# EAGLE design Steeringwheel wired remote (EAGLE 7.2.0)
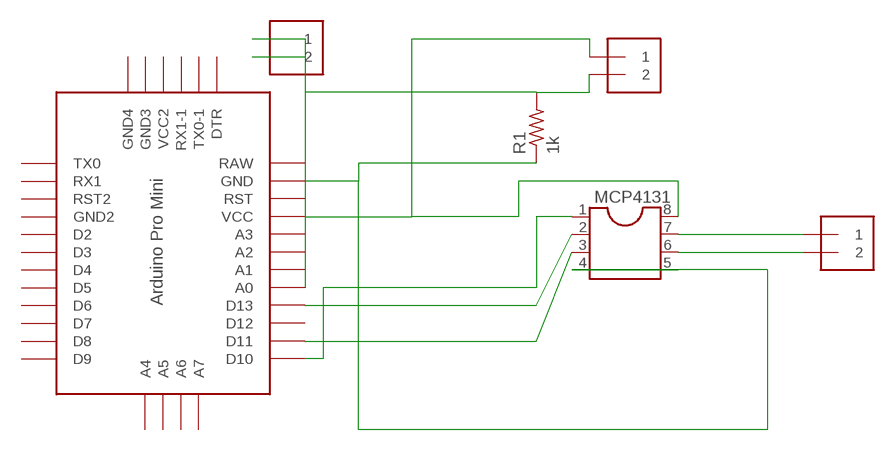
[diagram p0: schematic, sheet 1]

## Parts
IC1  DIL8  [DIL08]
INPUT  1X2-3.5MM  [1X2-3.5MM]
OUTPUT  1X2-3.5MM  [1X2-3.5MM]
POWER  1X2-3.5MM  [1X2-3.5MM]
R1  1k  R-US_0204/5  [0204/5]
U$1  PRO-MINI  [PRO-MINI]

## Nets
N$1: IC1.4(GND) IC1.5(P0A) POWER.1 R1.1 U$1.GND
N$2: IC1.1(!CS) U$1.D10
N$3: IC1.2(SCK) U$1.D13
N$4: IC1.3(SDI) U$1.D11
N$5: IC1.8(VCC) INPUT.1 POWER.2 U$1.VCC
N$6: IC1.7(P0B) OUTPUT.1
N$7: IC1.6(P0W) OUTPUT.2
N$8: INPUT.2 R1.2 U$1.A0
Unconnected: U$1.A1 U$1.A2 U$1.A3 U$1.A4 U$1.A5 U$1.A6 U$1.A7 U$1.D2 U$1.D3 U$1.D4 U$1.D5 U$1.D6 U$1.D7 U$1.D8 U$1.D9 U$1.D12 U$1.DTR U$1.GND1(GND2) U$1.GND2(GND4) U$1.GND3 U$1.RST U$1.RST1(RST2) U$1.RX1 U$1.RX1-1 U$1.TX0 U$1.TX0-1 U$1.VCC1(VCC2)

## Power pins joined to a net without a drawn wire
RAW: U$1.RAW

## Library data of the parts
IC1 = Own:DIL8: Dual In Line / Socket
INPUT OUTPUT POWER = adafruit:1X2: 3.5mm Terminal block http://www.ladyada.net/library/pcb/eaglelibrary.html
R1 = adafruit:R-US_: RESISTOR, American symbol
U$1 = Arduino-clone:PRO-MINI: Arduion Pro Mini Clone V1.0 www.betemcu.cu

## Board
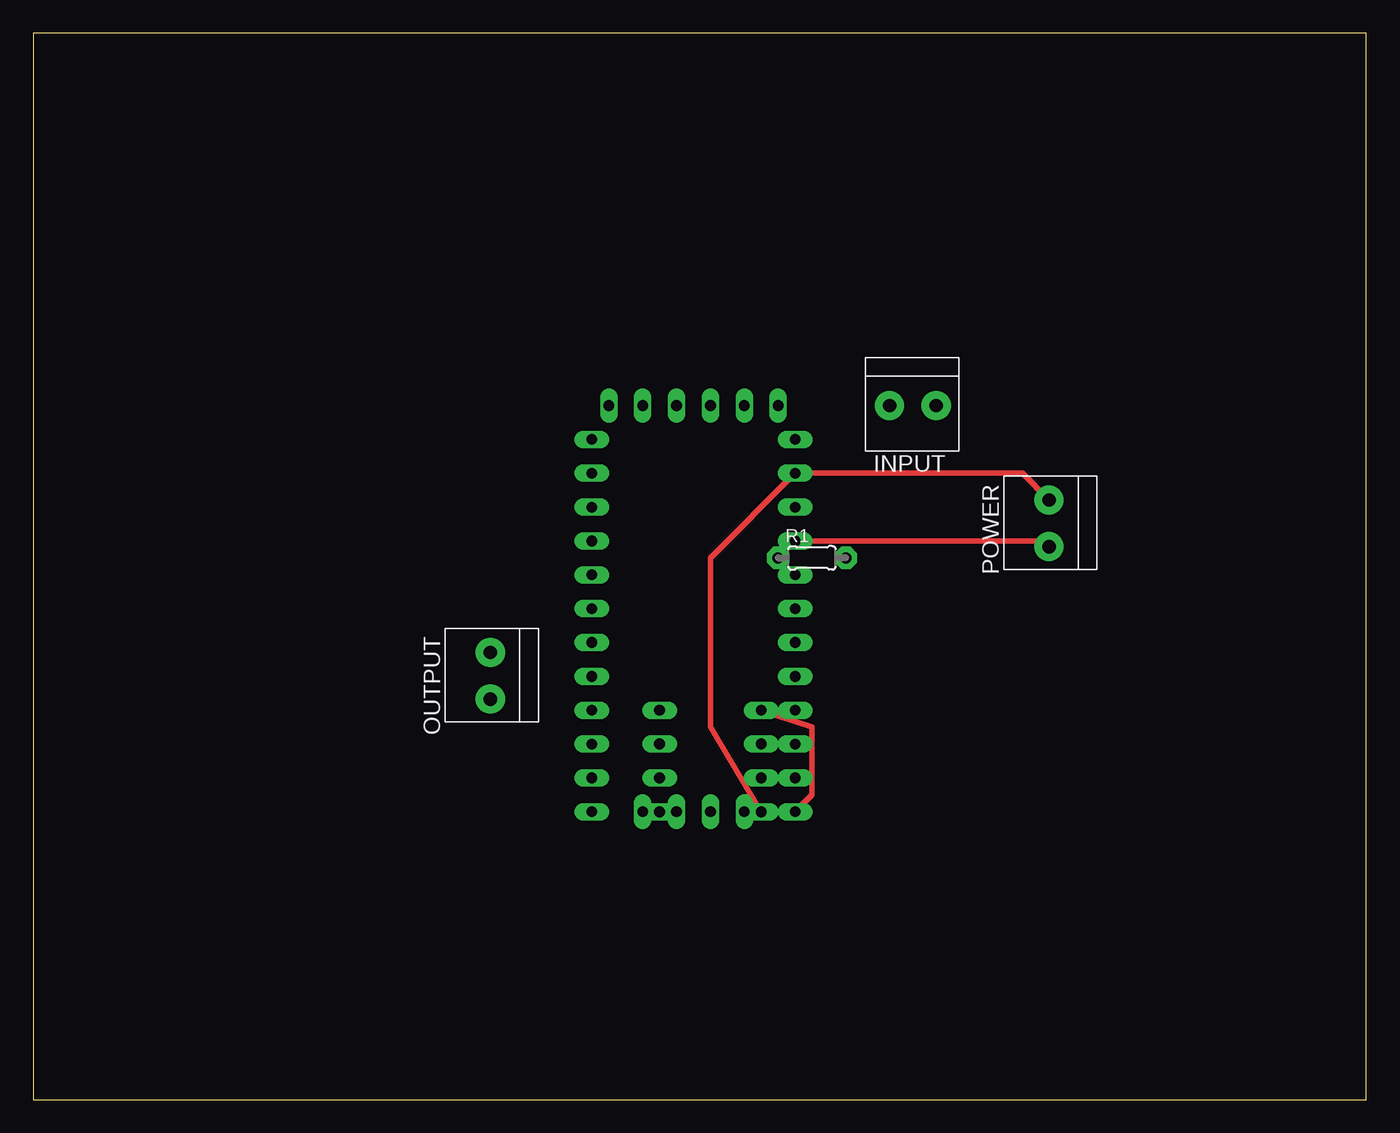
[diagram p1: board, top side]
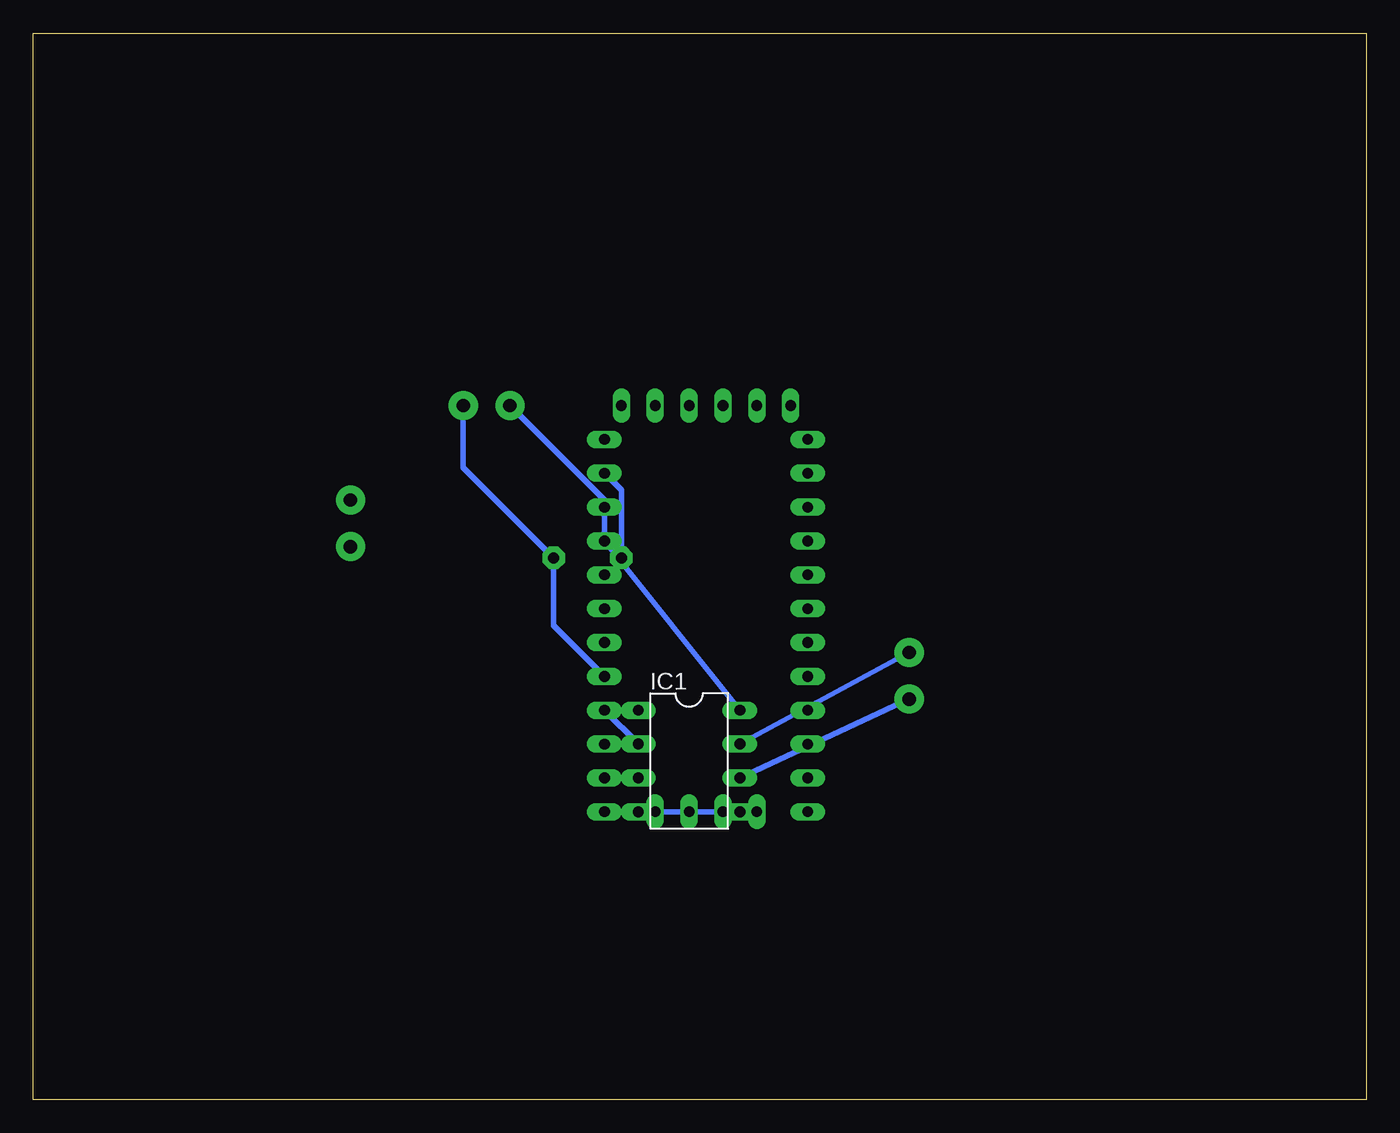
[diagram p2: board, bottom side, seen from below]

Size 100 x 80 mm. Coordinates in mm from the lower left corner, seen from the top.
Outline: 0,0 100,0 100,80 0,80 0,0
Copper layers (1*16): Top 0.035mm / dielectric 1.5mm / Bottom 0.035mm
Design rules "default": minimum track width 10mil, minimum drill 24mil, track to track 8mil, track to pad 8mil, pad to pad 8mil, via to via 8mil, smd to smd 8mil, copper to edge 40mil, drill to drill 8mil, minimum pad ring 10mil, minimum via ring 8mil, stop-mask expansion 4mil, vias tented up to drill 0mil, thermal gap 10mil

### Footprints (pad centres in the part's own frame; a part is rotated, then mirrored left to right if it is on the bottom)
DIL08 = drill 0.813 long: 1 -3.81,-3.81; 2 -1.27,-3.81; 3 1.27,-3.81; 4 3.81,-3.81; 5 3.81,3.81; 6 1.27,3.81; 7 -1.27,3.81; 8 -3.81,3.81
1X2-3.5MM = drill 1 pad 2.184: 1 1.8,0; 2 -1.7,0
0204/5 = drill 0.813 pad 1.676 octagon: 1 -2.54,0; 2 2.54,0
PRO-MINI = drill 0.8 long: A0 8.89,8.89; A1 8.89,11.43; A2 8.89,13.97; A3 8.89,16.51; A4 -2.54,-1.27; A5 0,-1.27; A6 2.54,-1.27; A7 5.08,-1.27; D2 -6.35,16.51; D3 -6.35,13.97; D4 -6.35,11.43; D5 -6.35,8.89; D6 -6.35,6.35; D7 -6.35,3.81; D8 -6.35,1.27; D9 -6.35,-1.27; D10 8.89,-1.27; D11 8.89,1.27; D12 8.89,3.81; D13 8.89,6.35; DTR 7.62,29.21; GND 8.89,24.13; GND1 -6.35,19.05; GND2 -5.08,29.21; GND3 -2.54,29.21; RAW 8.89,26.67; RST 8.89,21.59; RST1 -6.35,21.59; RX1 -6.35,24.13; RX1-1 2.54,29.21; TX0 -6.35,26.67; TX0-1 5.08,29.21; VCC 8.89,19.05; VCC1 0,29.21

### Placement (x,y rotation side)
IC1  50.8,25.4 270 bottom
INPUT  66.04,52.07 180 top
OUTPUT  34.29,31.75 90 top
POWER  76.2,43.18 90 top
R1  58.42,40.64 0 top
U$1  48.26,22.86 0 top

### Tracks (layer width: path | path; a pad name or v marks a point on that pad's centre or on a via)
N$1
  Top 0.406: IC1.4 50.8,27.94 50.8,40.64 U$1.GND 74.19,46.99 POWER.1
  Bottom 0.406: IC1.4 IC1.5 | R1.1 55.88,45.72 U$1.GND
N$2
  Top 0.406: IC1.1 58.42,27.94 58.42,22.86 U$1.D10
N$3
  Bottom 0.406: IC1.2 U$1.D13
N$4
  Bottom 0.406: IC1.3 U$1.D11
N$5
  Top 0.406: POWER.2 75.77,41.91 U$1.VCC
  Bottom 0.406: IC1.8 U$1.VCC 57.15,44.98 INPUT.1
N$6
  Bottom 0.406: OUTPUT.1 IC1.7
N$7
  Bottom 0.406: OUTPUT.2 IC1.6
N$8
  Bottom 0.406: INPUT.2 67.74,47.42 R1.2 60.96,35.56 U$1.A0